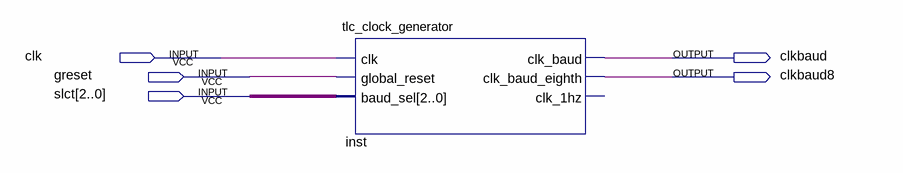
[diagram p0: schematic sheet]
// Quartus schematic BaudTest.bdf as structural Verilog: 1 symbols, 5 pins
module BaudTest (
  input  clk,
  input  greset,
  input  [2:0] slct,
  output clkbaud,
  output clkbaud8
);

  tlc_clock_generator inst (
    .clk(clk), .global_reset(greset), .baud_sel(slct), .clk_baud(clkbaud), .clk_baud_eighth(clkbaud8));  // open: clk_1hz
endmodule
